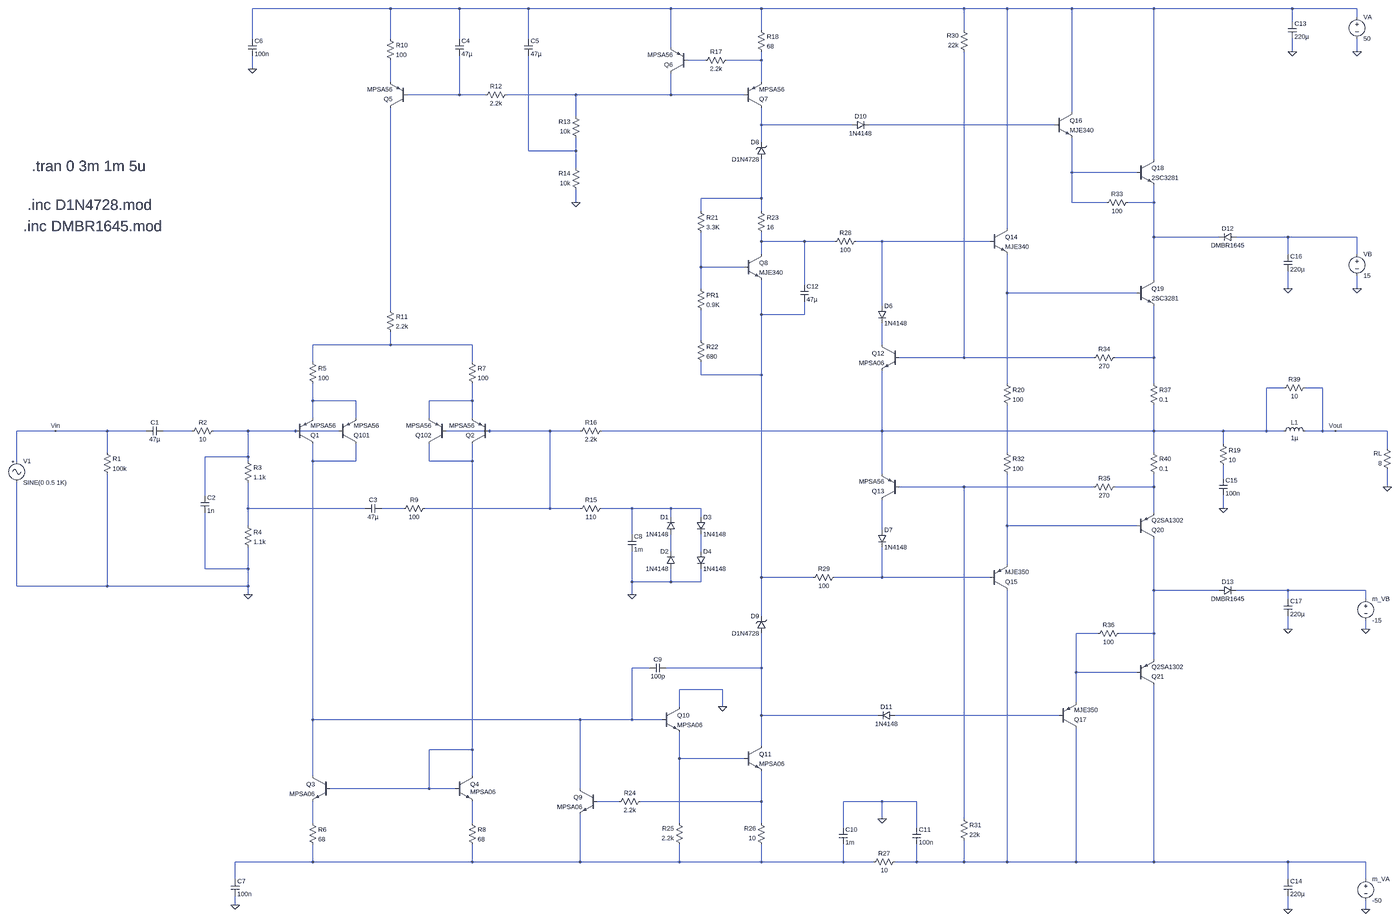
[diagram p0: schematic ClassG_DS.asc, whole sheet]
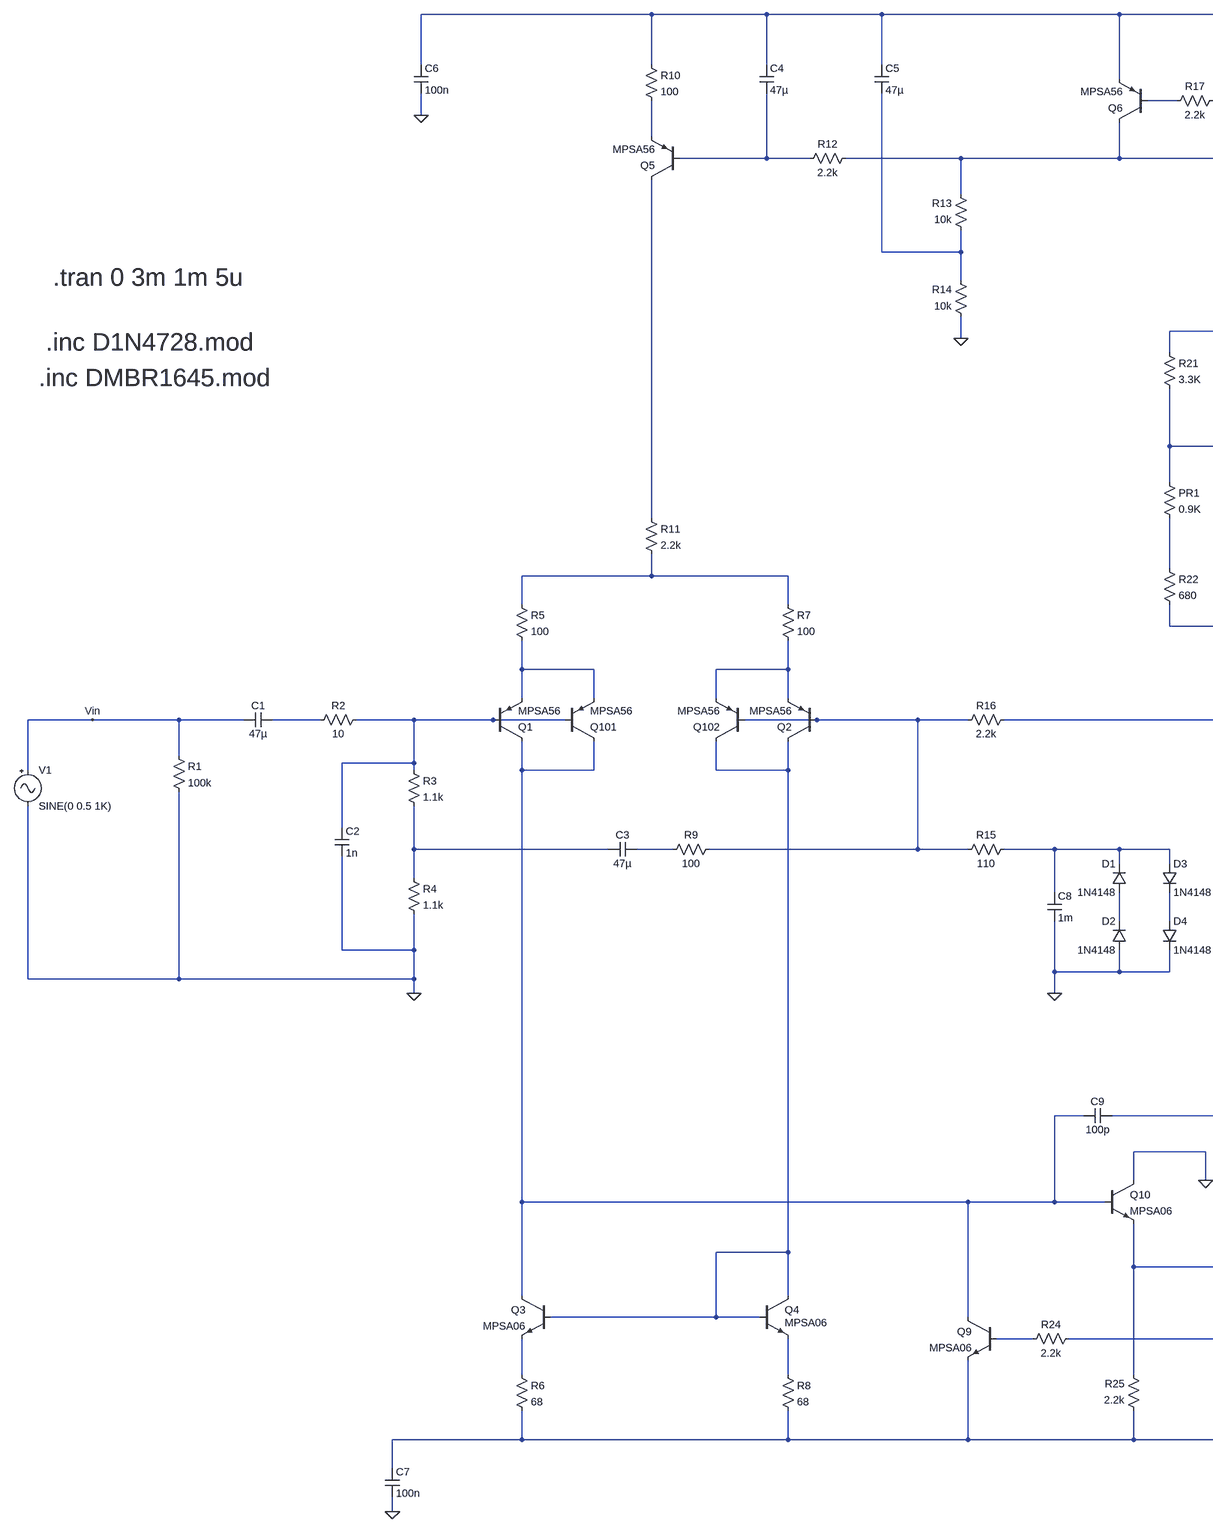
[diagram p1: schematic ClassG_DS.asc, part, row 1 of 1, column 1 of 2]
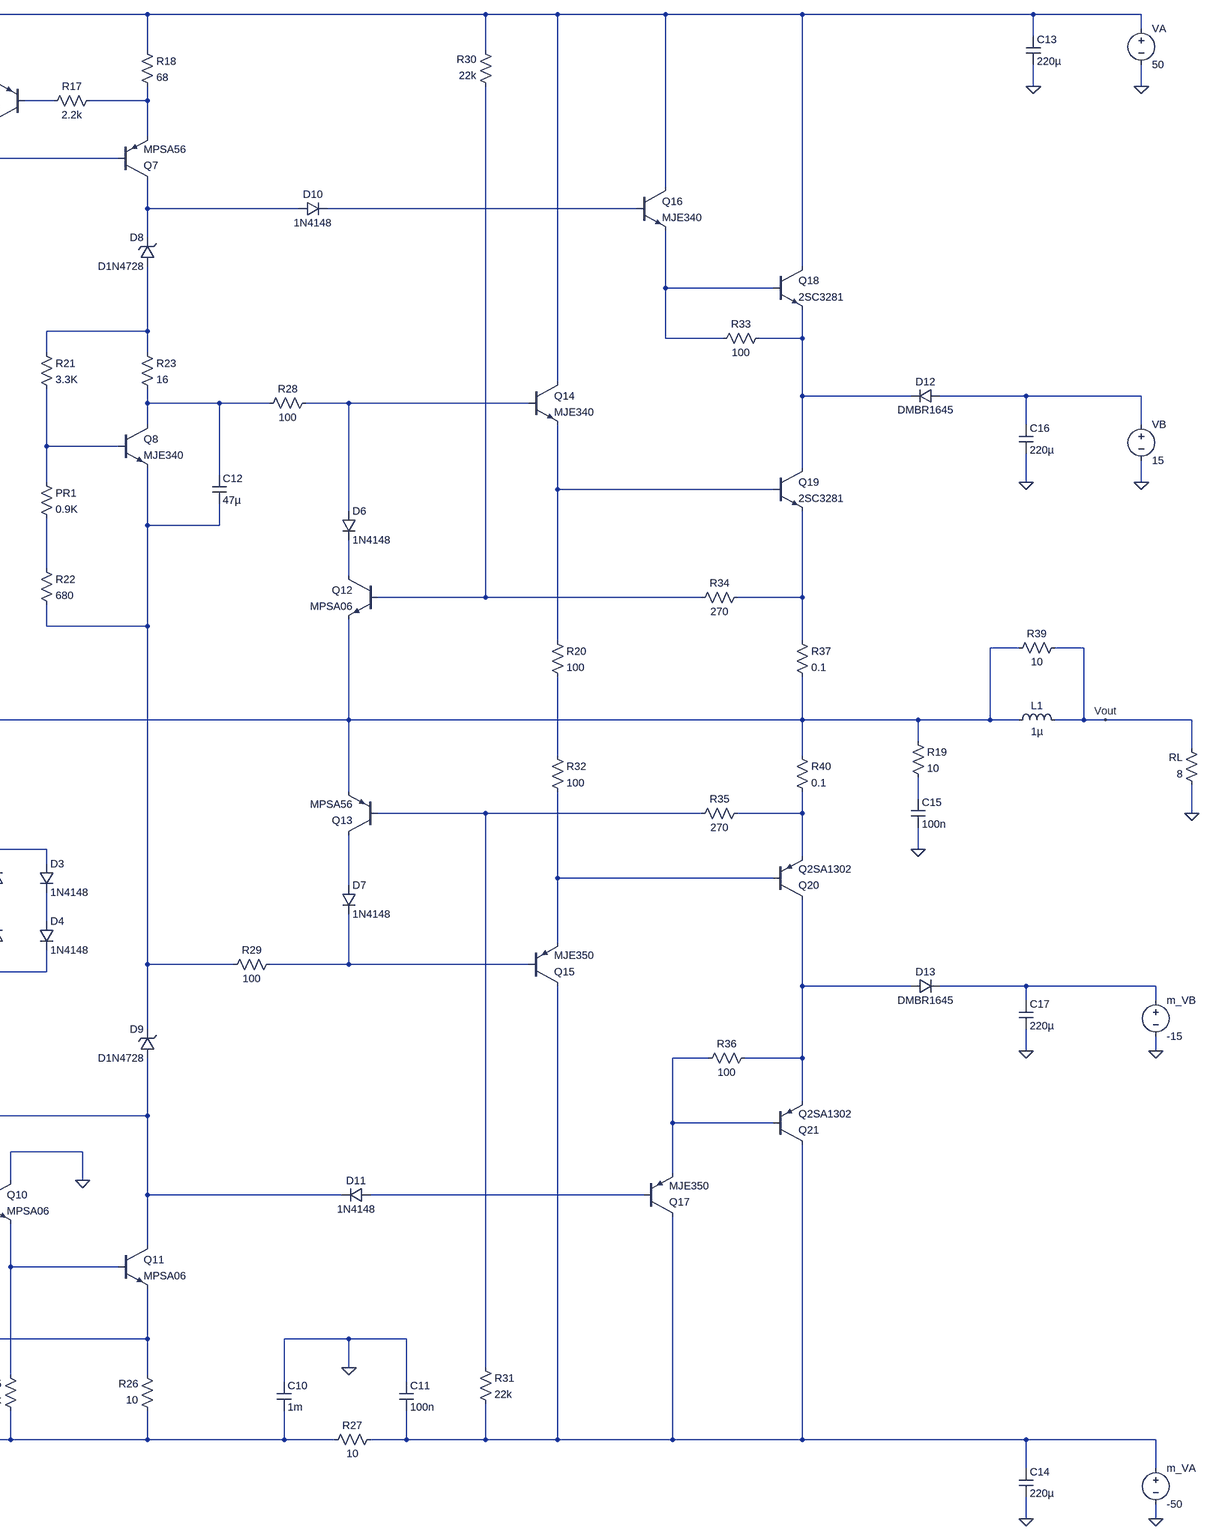
[diagram p2: schematic ClassG_DS.asc, part, row 1 of 1, column 2 of 2]
ClassG_DS.asc, the LTspice schematic file:
Version 4
SHEET 1 5148 1844
WIRE 1056 -1520 544 -1520
WIRE 1312 -1520 1056 -1520
WIRE 1568 -1520 1312 -1520
WIRE 2096 -1520 1568 -1520
WIRE 2432 -1520 2096 -1520
WIRE 3184 -1520 2432 -1520
WIRE 3344 -1520 3184 -1520
WIRE 3584 -1520 3344 -1520
WIRE 3888 -1520 3584 -1520
WIRE 4560 -1520 3888 -1520
WIRE 4800 -1520 4560 -1520
WIRE 4800 -1488 4800 -1520
WIRE 4560 -1472 4560 -1520
WIRE 2432 -1440 2432 -1520
WIRE 3184 -1440 3184 -1520
WIRE 544 -1408 544 -1520
WIRE 1056 -1408 1056 -1520
WIRE 1312 -1408 1312 -1520
WIRE 1568 -1408 1568 -1520
WIRE 2096 -1376 2096 -1520
WIRE 4560 -1360 4560 -1408
WIRE 4800 -1360 4800 -1408
WIRE 2224 -1328 2160 -1328
WIRE 2400 -1328 2304 -1328
WIRE 2432 -1328 2432 -1360
WIRE 2432 -1328 2400 -1328
WIRE 544 -1296 544 -1344
WIRE 1056 -1248 1056 -1328
WIRE 2432 -1248 2432 -1328
WIRE 1216 -1200 1120 -1200
WIRE 1312 -1200 1312 -1344
WIRE 1312 -1200 1216 -1200
WIRE 1408 -1200 1312 -1200
WIRE 1744 -1200 1488 -1200
WIRE 1872 -1200 1744 -1200
WIRE 2096 -1200 2096 -1280
WIRE 2096 -1200 1872 -1200
WIRE 2368 -1200 2096 -1200
WIRE 3584 -1136 3584 -1520
WIRE 1744 -1120 1744 -1200
WIRE 2432 -1088 2432 -1152
WIRE 2768 -1088 2432 -1088
WIRE 3264 -1088 2832 -1088
WIRE 3520 -1088 3264 -1088
WIRE 2432 -1024 2432 -1088
WIRE 1568 -992 1568 -1344
WIRE 1632 -992 1568 -992
WIRE 1744 -992 1744 -1040
WIRE 1744 -992 1632 -992
WIRE 3888 -960 3888 -1520
WIRE 1744 -928 1744 -992
WIRE 3584 -912 3584 -1040
WIRE 3696 -912 3584 -912
WIRE 3824 -912 3696 -912
WIRE 2432 -880 2432 -960
WIRE 1056 -864 1056 -1152
WIRE 2432 -816 2432 -880
WIRE 2432 -816 2208 -816
WIRE 1744 -800 1744 -848
WIRE 3584 -800 3584 -912
WIRE 3712 -800 3584 -800
WIRE 3888 -800 3888 -864
WIRE 3888 -800 3792 -800
WIRE 2208 -768 2208 -816
WIRE 2432 -768 2432 -816
WIRE 3344 -704 3344 -1520
WIRE 3888 -672 3888 -800
WIRE 4288 -672 3888 -672
WIRE 4544 -672 4352 -672
WIRE 4800 -672 4544 -672
WIRE 2432 -656 2432 -688
WIRE 2592 -656 2432 -656
WIRE 2704 -656 2592 -656
WIRE 2880 -656 2784 -656
WIRE 3024 -656 2880 -656
WIRE 3280 -656 3024 -656
WIRE 2432 -608 2432 -656
WIRE 4544 -608 4544 -672
WIRE 4800 -608 4800 -672
WIRE 2208 -560 2208 -688
WIRE 2368 -560 2208 -560
WIRE 3888 -512 3888 -672
WIRE 2592 -496 2592 -656
WIRE 2208 -480 2208 -560
WIRE 4544 -480 4544 -544
WIRE 4800 -480 4800 -528
WIRE 3344 -464 3344 -608
WIRE 3488 -464 3344 -464
WIRE 3824 -464 3488 -464
WIRE 2880 -416 2880 -656
WIRE 1056 -400 1056 -864
WIRE 2432 -384 2432 -512
WIRE 2592 -384 2592 -432
WIRE 2592 -384 2432 -384
WIRE 2208 -288 2208 -400
WIRE 1056 -272 1056 -320
WIRE 1056 -272 768 -272
WIRE 1200 -272 1056 -272
WIRE 1360 -272 1200 -272
WIRE 2880 -272 2880 -352
WIRE 3088 -224 2944 -224
WIRE 3184 -224 3184 -1360
WIRE 3184 -224 3088 -224
WIRE 3664 -224 3184 -224
WIRE 3888 -224 3888 -416
WIRE 3888 -224 3744 -224
WIRE 768 -208 768 -272
WIRE 1360 -208 1360 -272
WIRE 2208 -160 2208 -208
WIRE 2432 -160 2432 -384
WIRE 2432 -160 2208 -160
WIRE 3344 -128 3344 -464
WIRE 3888 -128 3888 -224
WIRE 4528 -112 4464 -112
WIRE 4672 -112 4608 -112
WIRE 768 -64 768 -128
WIRE 928 -64 768 -64
WIRE 1360 -64 1360 -128
WIRE 1360 -64 1200 -64
WIRE 2432 -64 2432 -160
WIRE 768 0 768 -64
WIRE 928 0 928 -64
WIRE 1200 0 1200 -64
WIRE 1360 0 1360 -64
WIRE -208 48 -352 48
WIRE -80 48 -208 48
WIRE -16 48 -80 48
WIRE 128 48 -16 48
WIRE 320 48 192 48
WIRE 528 48 400 48
WIRE 544 48 528 48
WIRE 704 48 544 48
WIRE 864 48 704 48
WIRE 1424 48 1264 48
WIRE 1648 48 1424 48
WIRE 1760 48 1648 48
WIRE 2880 48 2880 -176
WIRE 2880 48 1840 48
WIRE 3888 48 3888 -48
WIRE 3888 48 2880 48
WIRE 4112 48 3888 48
WIRE 4304 48 4112 48
WIRE 4464 48 4464 -112
WIRE 4464 48 4304 48
WIRE 4528 48 4464 48
WIRE 4672 48 4672 -112
WIRE 4672 48 4608 48
WIRE 4720 48 4672 48
WIRE 4896 48 4720 48
WIRE 4912 48 4896 48
WIRE 4304 96 4304 48
WIRE 4912 112 4912 48
WIRE -16 128 -16 48
WIRE 3344 128 3344 -48
WIRE 3888 128 3888 48
WIRE 528 144 528 48
WIRE 528 144 368 144
WIRE -352 160 -352 48
WIRE 528 160 528 144
WIRE 768 160 768 96
WIRE 928 160 928 96
WIRE 928 160 768 160
WIRE 1200 160 1200 96
WIRE 1360 160 1360 96
WIRE 1360 160 1200 160
WIRE 2880 208 2880 48
WIRE 4304 224 4304 176
WIRE 3072 256 2944 256
WIRE 3184 256 3072 256
WIRE 3664 256 3184 256
WIRE 3888 256 3888 208
WIRE 3888 256 3744 256
WIRE 4912 256 4912 192
WIRE 368 288 368 144
WIRE 528 336 528 240
WIRE 624 336 528 336
WIRE 960 336 624 336
WIRE 1104 336 1024 336
WIRE 1552 336 1184 336
WIRE 1648 336 1648 48
WIRE 1648 336 1552 336
WIRE 1760 336 1648 336
WIRE 1952 336 1840 336
WIRE 2096 336 1952 336
WIRE 2208 336 2096 336
WIRE 4304 336 4304 288
WIRE 3888 352 3888 256
WIRE 2096 368 2096 336
WIRE 2208 368 2208 336
WIRE 528 400 528 336
WIRE 3344 400 3344 208
WIRE 3472 400 3344 400
WIRE 3824 400 3472 400
WIRE 2880 416 2880 304
WIRE 1952 432 1952 336
WIRE 2096 496 2096 432
WIRE 2208 496 2208 432
WIRE 3344 544 3344 400
WIRE 368 560 368 352
WIRE 528 560 528 480
WIRE 528 560 368 560
WIRE 2432 592 2432 -64
WIRE 2624 592 2432 592
WIRE 2880 592 2880 480
WIRE 2880 592 2704 592
WIRE 2976 592 2880 592
WIRE 3280 592 2976 592
WIRE 1952 608 1952 496
WIRE 2096 608 2096 560
WIRE 2096 608 1952 608
WIRE 2208 608 2208 560
WIRE 2208 608 2096 608
WIRE -352 624 -352 240
WIRE -16 624 -16 208
WIRE -16 624 -352 624
WIRE 528 624 528 560
WIRE 528 624 -16 624
WIRE 3888 640 3888 448
WIRE 4016 640 3888 640
WIRE 4288 640 4016 640
WIRE 4544 640 4352 640
WIRE 4832 640 4544 640
WIRE 528 656 528 624
WIRE 1952 656 1952 608
WIRE 4544 672 4544 640
WIRE 4832 672 4832 640
WIRE 2432 736 2432 592
WIRE 4544 784 4544 736
WIRE 4832 784 4832 752
WIRE 1360 800 1360 160
WIRE 3680 800 3600 800
WIRE 3888 800 3888 640
WIRE 3888 800 3760 800
WIRE 768 816 768 160
WIRE 3888 896 3888 800
WIRE 2016 928 1952 928
WIRE 2432 928 2432 800
WIRE 2432 928 2080 928
WIRE 3600 944 3600 800
WIRE 3680 944 3600 944
WIRE 3824 944 3680 944
WIRE 2288 1008 2128 1008
WIRE 3600 1056 3600 944
WIRE 2128 1072 2128 1008
WIRE 2288 1072 2288 1008
WIRE 2432 1104 2432 928
WIRE 2864 1104 2432 1104
WIRE 3264 1104 2928 1104
WIRE 3536 1104 3264 1104
WIRE 768 1120 768 816
WIRE 1760 1120 768 1120
WIRE 1952 1120 1952 928
WIRE 1952 1120 1760 1120
WIRE 2064 1120 1952 1120
WIRE 2432 1216 2432 1104
WIRE 1360 1232 1360 800
WIRE 1360 1232 1200 1232
WIRE 2128 1264 2128 1168
WIRE 2208 1264 2128 1264
WIRE 2368 1264 2208 1264
WIRE 768 1328 768 1120
WIRE 1360 1328 1360 1232
WIRE 1200 1376 1200 1232
WIRE 1200 1376 832 1376
WIRE 1296 1376 1200 1376
WIRE 1760 1376 1760 1120
WIRE 1904 1424 1824 1424
WIRE 2256 1424 1984 1424
WIRE 2432 1424 2432 1312
WIRE 2432 1424 2256 1424
WIRE 2880 1424 2736 1424
WIRE 3008 1424 2880 1424
WIRE 2880 1488 2880 1424
WIRE 3184 1488 3184 256
WIRE 768 1504 768 1424
WIRE 1360 1504 1360 1424
WIRE 2128 1504 2128 1264
WIRE 2432 1504 2432 1424
WIRE 2736 1520 2736 1424
WIRE 3008 1520 3008 1424
WIRE 768 1648 768 1584
WIRE 768 1648 480 1648
WIRE 1360 1648 1360 1584
WIRE 1360 1648 768 1648
WIRE 1760 1648 1760 1472
WIRE 1760 1648 1360 1648
WIRE 2128 1648 2128 1584
WIRE 2128 1648 1760 1648
WIRE 2432 1648 2432 1584
WIRE 2432 1648 2128 1648
WIRE 2736 1648 2736 1584
WIRE 2736 1648 2432 1648
WIRE 2848 1648 2736 1648
WIRE 3008 1648 3008 1584
WIRE 3008 1648 2928 1648
WIRE 3184 1648 3184 1568
WIRE 3184 1648 3008 1648
WIRE 3344 1648 3344 640
WIRE 3344 1648 3184 1648
WIRE 3600 1648 3600 1152
WIRE 3600 1648 3344 1648
WIRE 3888 1648 3888 992
WIRE 3888 1648 3600 1648
WIRE 4544 1648 3888 1648
WIRE 4832 1648 4544 1648
WIRE 480 1712 480 1648
WIRE 4544 1712 4544 1648
WIRE 4832 1712 4832 1648
WIRE 480 1808 480 1776
WIRE 4544 1824 4544 1776
WIRE 4832 1824 4832 1792
FLAG 528 656 0
FLAG 1952 656 0
FLAG 2880 1488 0
FLAG 2288 1072 0
FLAG 4544 784 0
FLAG 4544 1824 0
FLAG 4832 1824 0
FLAG 4832 784 0
FLAG 1744 -800 0
FLAG 544 -1296 0
FLAG 4560 -1360 0
FLAG 4800 -1360 0
FLAG 4800 -480 0
FLAG 4544 -480 0
FLAG 4304 336 0
FLAG 4912 256 0
FLAG 480 1808 0
FLAG 4720 48 Vout
FLAG -208 48 Vin
DATAFLAG 4112 48 ""
DATAFLAG 4896 48 ""
DATAFLAG 4016 640 ""
DATAFLAG 1552 336 ""
DATAFLAG 768 816 ""
DATAFLAG 1360 800 ""
DATAFLAG 544 48 ""
DATAFLAG 2256 1424 ""
DATAFLAG 2208 1264 ""
DATAFLAG 2432 -64 ""
DATAFLAG 2432 -880 ""
DATAFLAG 3024 -656 ""
DATAFLAG 3088 -224 ""
DATAFLAG 3072 256 ""
DATAFLAG 3488 -464 ""
DATAFLAG 3472 400 ""
DATAFLAG 3680 944 ""
DATAFLAG 3696 -912 ""
DATAFLAG 1872 -1200 ""
DATAFLAG 1200 -272 ""
DATAFLAG 1056 -864 ""
DATAFLAG 624 336 ""
DATAFLAG -80 48 ""
DATAFLAG 3264 1104 ""
DATAFLAG 2976 592 ""
DATAFLAG 3264 -1088 ""
DATAFLAG 2400 -1328 ""
DATAFLAG 1216 -1200 ""
DATAFLAG 1632 -992 ""
SYMBOL res -32 112 R0
SYMATTR InstName R1
SYMATTR Value 100k
SYMBOL res 416 32 R90
WINDOW 0 0 56 VBottom 2
WINDOW 3 32 56 VTop 2
SYMATTR InstName R2
SYMATTR Value 10
SYMBOL cap 192 32 R90
WINDOW 0 0 32 VBottom 2
WINDOW 3 32 32 VTop 2
SYMATTR InstName C1
SYMATTR Value 47µ
SYMBOL res 512 144 R0
SYMATTR InstName R3
SYMATTR Value 1.1k
SYMBOL res 512 384 R0
SYMATTR InstName R4
SYMATTR Value 1.1k
SYMBOL cap 352 288 R0
SYMATTR InstName C2
SYMATTR Value 1n
SYMBOL pnp 704 96 M180
SYMATTR InstName Q1
SYMATTR Value MPSA56
SYMBOL pnp 864 96 M180
SYMATTR InstName Q101
SYMATTR Value MPSA56
SYMBOL pnp 1264 96 R180
SYMATTR InstName Q102
SYMATTR Value MPSA56
SYMBOL pnp 1424 96 R180
SYMATTR InstName Q2
SYMATTR Value MPSA56
SYMBOL res 752 -224 R0
SYMATTR InstName R5
SYMATTR Value 100
SYMBOL res 1344 -224 R0
SYMATTR InstName R7
SYMATTR Value 100
SYMBOL res 1040 -416 R0
SYMATTR InstName R11
SYMATTR Value 2.2k
SYMBOL res 1856 32 R90
WINDOW 0 0 56 VBottom 2
WINDOW 3 32 56 VTop 2
SYMATTR InstName R16
SYMATTR Value 2.2k
SYMBOL res 1200 320 R90
WINDOW 0 0 56 VBottom 2
WINDOW 3 32 56 VTop 2
SYMATTR InstName R9
SYMATTR Value 100
SYMBOL cap 1024 320 R90
WINDOW 0 0 32 VBottom 2
WINDOW 3 32 32 VTop 2
SYMATTR InstName C3
SYMATTR Value 47µ
SYMBOL res 1856 320 R90
WINDOW 0 0 56 VBottom 2
WINDOW 3 32 56 VTop 2
SYMATTR InstName R15
SYMATTR Value 110
SYMBOL cap 1936 432 R0
SYMATTR InstName C8
SYMATTR Value 1m
SYMBOL diode 2112 432 R180
WINDOW 0 24 64 Left 2
WINDOW 3 24 0 Left 2
SYMATTR InstName D1
SYMATTR Value 1N4148
SYMBOL diode 2192 368 R0
SYMATTR InstName D3
SYMATTR Value 1N4148
SYMBOL diode 2192 496 R0
SYMATTR InstName D4
SYMATTR Value 1N4148
SYMBOL diode 2112 560 R180
WINDOW 0 24 64 Left 2
WINDOW 3 24 0 Left 2
SYMATTR InstName D2
SYMATTR Value 1N4148
SYMBOL Misc\\signal -352 144 R0
WINDOW 123 0 0 Left 2
WINDOW 39 0 0 Left 2
SYMATTR InstName V1
SYMATTR Value SINE(0 0.5 1K)
SYMBOL npn 832 1328 M0
SYMATTR InstName Q3
SYMATTR Value MPSA06
SYMBOL npn 1296 1328 R0
WINDOW 3 56 60 Left 2
SYMATTR Value MPSA06
SYMATTR InstName Q4
SYMBOL res 752 1488 R0
SYMATTR InstName R6
SYMATTR Value 68
SYMBOL res 1344 1488 R0
SYMATTR InstName R8
SYMATTR Value 68
SYMBOL npn 1824 1376 M0
SYMATTR InstName Q9
SYMATTR Value MPSA06
SYMBOL npn 2064 1072 R0
SYMATTR InstName Q10
SYMATTR Value MPSA06
SYMBOL npn 2368 1216 R0
SYMATTR InstName Q11
SYMATTR Value MPSA06
SYMBOL res 2000 1408 R90
WINDOW 0 0 56 VBottom 2
WINDOW 3 32 56 VTop 2
SYMATTR InstName R24
SYMATTR Value 2.2k
SYMBOL res 2144 1600 R180
WINDOW 0 36 76 Left 2
WINDOW 3 36 40 Left 2
SYMATTR InstName R25
SYMATTR Value 2.2k
SYMBOL res 2448 1600 R180
WINDOW 0 36 76 Left 2
WINDOW 3 36 40 Left 2
SYMATTR InstName R26
SYMATTR Value 10
SYMBOL cap 2080 912 R90
WINDOW 0 0 32 VBottom 2
WINDOW 3 32 32 VTop 2
SYMATTR InstName C9
SYMATTR Value 100p
SYMBOL cap 2720 1520 R0
SYMATTR InstName C10
SYMATTR Value 1m
SYMBOL cap 2992 1520 R0
SYMATTR InstName C11
SYMATTR Value 100n
SYMBOL res 2944 1632 R90
WINDOW 0 0 56 VBottom 2
WINDOW 3 32 56 VTop 2
SYMATTR InstName R27
SYMATTR Value 10
SYMBOL res 2720 576 R90
WINDOW 0 0 56 VBottom 2
WINDOW 3 32 56 VTop 2
SYMATTR InstName R29
SYMATTR Value 100
SYMBOL diode 2864 416 R0
SYMATTR InstName D7
SYMATTR Value 1N4148
SYMBOL pnp 2944 304 R180
SYMATTR InstName Q13
SYMATTR Value MPSA56
SYMBOL res 3168 1472 R0
SYMATTR InstName R31
SYMATTR Value 22k
SYMBOL pnp 3280 640 M180
SYMATTR InstName Q15
SYMATTR Value MJE350
SYMBOL pnp 3824 448 M180
SYMATTR InstName Q20
SYMATTR Value Q2SA1302
SYMBOL res 3872 112 R0
SYMATTR InstName R40
SYMATTR Value 0.1
SYMBOL res 3328 112 R0
SYMATTR InstName R32
SYMATTR Value 100
SYMBOL res 3760 240 R90
WINDOW 0 0 56 VBottom 2
WINDOW 3 32 56 VTop 2
SYMATTR InstName R35
SYMATTR Value 270
SYMBOL zener 2448 800 R180
WINDOW 0 24 64 Left 2
WINDOW 3 24 0 Left 2
SYMATTR InstName D9
SYMATTR Value D1N4728
SYMBOL pnp 3824 992 M180
SYMATTR InstName Q21
SYMATTR Value Q2SA1302
SYMBOL pnp 3536 1152 M180
SYMATTR InstName Q17
SYMATTR Value MJE350
SYMBOL res 3776 784 R90
WINDOW 0 0 56 VBottom 2
WINDOW 3 32 56 VTop 2
SYMATTR InstName R36
SYMATTR Value 100
SYMBOL diode 2928 1088 R90
WINDOW 0 0 32 VBottom 2
WINDOW 3 32 32 VTop 2
SYMATTR InstName D11
SYMATTR Value 1N4148
SYMBOL diode 4288 656 R270
WINDOW 0 32 32 VTop 2
WINDOW 3 0 32 VBottom 2
SYMATTR InstName D13
SYMATTR Value DMBR1645
SYMBOL cap 4528 672 R0
SYMATTR InstName C17
SYMATTR Value 220µ
SYMBOL cap 4528 1712 R0
SYMATTR InstName C14
SYMATTR Value 220µ
SYMBOL voltage 4832 656 R0
SYMATTR InstName m_VB
SYMATTR Value -15
SYMBOL voltage 4832 1696 R0
SYMATTR InstName m_VA
SYMATTR Value -50
SYMBOL pnp 1120 -1152 R180
SYMATTR InstName Q5
SYMATTR Value MPSA56
SYMBOL res 1040 -1424 R0
SYMATTR InstName R10
SYMATTR Value 100
SYMBOL cap 528 -1408 R0
SYMATTR InstName C6
SYMATTR Value 100n
SYMBOL cap 1296 -1408 R0
SYMATTR InstName C4
SYMATTR Value 47µ
SYMBOL cap 1552 -1408 R0
SYMATTR InstName C5
SYMATTR Value 47µ
SYMBOL res 1504 -1216 R90
WINDOW 0 0 56 VBottom 2
WINDOW 3 32 56 VTop 2
SYMATTR InstName R12
SYMATTR Value 2.2k
SYMBOL res 1760 -1024 R180
WINDOW 0 36 76 Left 2
WINDOW 3 36 40 Left 2
SYMATTR InstName R13
SYMATTR Value 10k
SYMBOL res 1760 -832 R180
WINDOW 0 36 76 Left 2
WINDOW 3 36 40 Left 2
SYMATTR InstName R14
SYMATTR Value 10k
SYMBOL pnp 2160 -1280 R180
SYMATTR InstName Q6
SYMATTR Value MPSA56
SYMBOL pnp 2368 -1152 M180
SYMATTR InstName Q7
SYMATTR Value MPSA56
SYMBOL res 2416 -1456 R0
SYMATTR InstName R18
SYMATTR Value 68
SYMBOL res 2320 -1344 R90
WINDOW 0 0 56 VBottom 2
WINDOW 3 32 56 VTop 2
SYMATTR InstName R17
SYMATTR Value 2.2k
SYMBOL zener 2448 -960 R180
WINDOW 0 24 64 Left 2
WINDOW 3 24 0 Left 2
SYMATTR InstName D8
SYMATTR Value D1N4728
SYMBOL res 2416 -784 R0
SYMATTR InstName R23
SYMATTR Value 16
SYMBOL res 2192 -784 R0
SYMATTR InstName R21
SYMATTR Value 3.3K
SYMBOL res 2192 -496 R0
SYMATTR InstName PR1
SYMATTR Value 0.9K
SYMBOL res 2192 -304 R0
SYMATTR InstName R22
SYMATTR Value 680
SYMBOL npn 2368 -608 R0
SYMATTR InstName Q8
SYMATTR Value MJE340
SYMBOL cap 2576 -496 R0
SYMATTR InstName C12
SYMATTR Value 47µ
SYMBOL res 3328 -144 R0
SYMATTR InstName R20
SYMATTR Value 100
SYMBOL res 3872 -144 R0
SYMATTR InstName R37
SYMATTR Value 0.1
SYMBOL res 3760 -240 R90
WINDOW 0 0 56 VBottom 2
WINDOW 3 32 56 VTop 2
SYMATTR InstName R34
SYMATTR Value 270
SYMBOL npn 2944 -272 M0
SYMATTR InstName Q12
SYMATTR Value MPSA06
SYMBOL diode 2864 -416 R0
SYMATTR InstName D6
SYMATTR Value 1N4148
SYMBOL res 2800 -672 R90
WINDOW 0 0 56 VBottom 2
WINDOW 3 32 56 VTop 2
SYMATTR InstName R28
SYMATTR Value 100
SYMBOL res 3200 -1344 R180
WINDOW 0 36 76 Left 2
WINDOW 3 36 40 Left 2
SYMATTR InstName R30
SYMATTR Value 22k
SYMBOL npn 3280 -704 R0
SYMATTR InstName Q14
SYMATTR Value MJE340
SYMBOL npn 3824 -512 R0
SYMATTR InstName Q19
SYMATTR Value 2SC3281
SYMBOL npn 3520 -1136 R0
SYMATTR InstName Q16
SYMATTR Value MJE340
SYMBOL npn 3824 -960 R0
SYMATTR InstName Q18
SYMATTR Value 2SC3281
SYMBOL diode 2768 -1072 R270
WINDOW 0 32 32 VTop 2
WINDOW 3 0 32 VBottom 2
SYMATTR InstName D10
SYMATTR Value 1N4148
SYMBOL res 3808 -816 R90
WINDOW 0 0 56 VBottom 2
WINDOW 3 32 56 VTop 2
SYMATTR InstName R33
SYMATTR Value 100
SYMBOL diode 4352 -688 R90
WINDOW 0 0 32 VBottom 2
WINDOW 3 32 32 VTop 2
SYMATTR InstName D12
SYMATTR Value DMBR1645
SYMBOL cap 4528 -608 R0
SYMATTR InstName C16
SYMATTR Value 220µ
SYMBOL voltage 4800 -624 R0
SYMATTR InstName VB
SYMATTR Value 15
SYMBOL voltage 4800 -1504 R0
SYMATTR InstName VA
SYMATTR Value 50
SYMBOL cap 4544 -1472 R0
SYMATTR InstName C13
SYMATTR Value 220µ
SYMBOL res 4288 80 R0
SYMATTR InstName R19
SYMATTR Value 10
SYMBOL cap 4288 224 R0
SYMATTR InstName C15
SYMATTR Value 100n
SYMBOL ind 4512 64 R270
WINDOW 0 32 56 VTop 2
WINDOW 3 5 56 VBottom 2
SYMATTR InstName L1
SYMATTR Value 1µ
SYMBOL res 4624 -128 R90
WINDOW 0 0 56 VBottom 2
WINDOW 3 32 56 VTop 2
SYMATTR InstName R39
SYMATTR Value 10
SYMBOL res 4928 208 R180
WINDOW 0 36 76 Left 2
WINDOW 3 36 40 Left 2
SYMATTR InstName RL
SYMATTR Value 8
SYMBOL cap 464 1712 R0
SYMATTR InstName C7
SYMATTR Value 100n
TEXT -328 -712 Left 5 !.inc DMBR1645.mod
TEXT -312 -792 Left 5 !.inc D1N4728.mod
TEXT -296 -936 Left 5 !.tran 0 3m 1m 5u

The netlist it stands for:
* ClassG_DS.asc
R1 Vin 0 100k
R2 N029 N028 10
C1 N028 Vin 47µ
R3 N029 N037 1.1k
R4 N037 0 1.1k
C2 N029 0 1n
Q1 N032 N029 N026 0 MPSA56
Q101 N032 N029 N026 0 MPSA56
Q102 N033 N030 N027 0 MPSA56
Q2 N033 N030 N027 0 MPSA56
R5 N021 N026 100
R7 N021 N027 100
R11 N012 N021 2.2k
R16 N025 N030 2.2k
R9 N030 N038 100
C3 N038 N037 47µ
R15 N039 N030 110
C8 N039 0 1m
D1 N042 N039 1N4148
D3 N039 N043 1N4148
D4 N043 0 1N4148
D2 0 N042 1N4148
V1 Vin 0 SINE(0 0.5 1K)
Q3 N032 N033 N053 0 MPSA06
Q4 N033 N033 N054 0 MPSA06
R6 N053 N055 68
R8 N054 N055 68
Q9 N032 N051 N055 0 MPSA06
Q10 0 N032 N050 0 MPSA06
Q11 N048 N050 N052 0 MPSA06
R24 N052 N051 2.2k
R25 N055 N050 2.2k
R26 N055 N052 10
C9 N048 N032 100p
C10 0 N055 1m
C11 0 N056 100n
R27 N056 N055 10
R29 N044 N019 100
D7 N041 N044 1N4148
Q13 N041 N035 N025 0 MPSA56
R31 N035 N056 22k
Q15 N056 N044 N040 0 MJE350
Q20 N045 N040 N036 0 Q2SA1302
R40 N025 N036 0.1
R32 N031 N040 100
R35 N036 N035 270
D9 N048 N019 D1N4728
Q21 N056 N047 N045 0 Q2SA1302
Q17 N056 N049 N047 0 MJE350
R36 N045 N047 100
D11 N049 N048 1N4148
D13 N045 N046 DMBR1645
C17 N046 0 220µ
C14 N056 0 220µ
V§m_VB N046 0 -15
V§m_VA N056 0 -50
Q5 N012 N005 N004 0 MPSA56
R10 N001 N004 100
C6 N001 0 100n
C4 N001 N005 47µ
C5 N001 N009 47µ
R12 N006 N005 2.2k
R13 N009 N006 10k
R14 0 N009 10k
Q6 N006 N002 N001 0 MPSA56
Q7 N007 N006 N003 0 MPSA56
R18 N001 N003 68
R17 N003 N002 2.2k
D8 N011 N007 D1N4728
R23 N011 N015 16
R21 N011 N017 3.3K
R§PR1 N017 N020 0.9K
R22 N020 N019 680
Q8 N015 N017 N019 0 MJE340
C12 N015 N019 47µ
R20 N018 N031 100
R37 N024 N025 0.1
R34 N024 N023 270
Q12 N022 N023 N025 0 MPSA06
D6 N016 N022 1N4148
R28 N016 N015 100
R30 N023 N001 22k
Q14 N001 N016 N018 0 MJE340
Q19 N013 N018 N024 0 2SC3281
Q16 N001 N008 N010 0 MJE340
Q18 N001 N010 N013 0 2SC3281
D10 N007 N008 1N4148
R33 N013 N010 100
D12 N014 N013 DMBR1645
C16 N014 0 220µ
VB N014 0 15
VA N001 0 50
C13 N001 0 220µ
R19 N025 N034 10
C15 N034 0 100n
L1 N025 Vout 1µ
R39 Vout N025 10
RL 0 Vout 8
C7 N055 0 100n
.model D D
.lib standard.dio
.model NPN NPN
.model PNP PNP
.lib standard.bjt
.inc DMBR1645.mod
.inc D1N4728.mod
.tran 0 3m 1m 5u
.backanno
.end